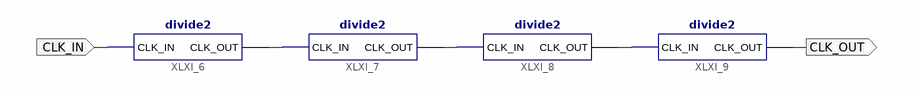
[diagram p0: schematic sheet 1]
// Xilinx ISE schematic divide2_4.sch (spartan6) as structural Verilog: 4 symbols, 2 ports
module divide2_4 (
  input  CLK_IN,
  output CLK_OUT
);

  wire XLXN_1, XLXN_2, XLXN_3;

  divide2 XLXI_6 (.CLK_IN(CLK_IN), .CLK_OUT(XLXN_1));
  divide2 XLXI_7 (.CLK_IN(XLXN_1), .CLK_OUT(XLXN_2));
  divide2 XLXI_8 (.CLK_IN(XLXN_2), .CLK_OUT(XLXN_3));
  divide2 XLXI_9 (.CLK_IN(XLXN_3), .CLK_OUT(CLK_OUT));
endmodule
